# EAGLE schematic Sopranino2GW-181 (EAGLE 9.0.1)
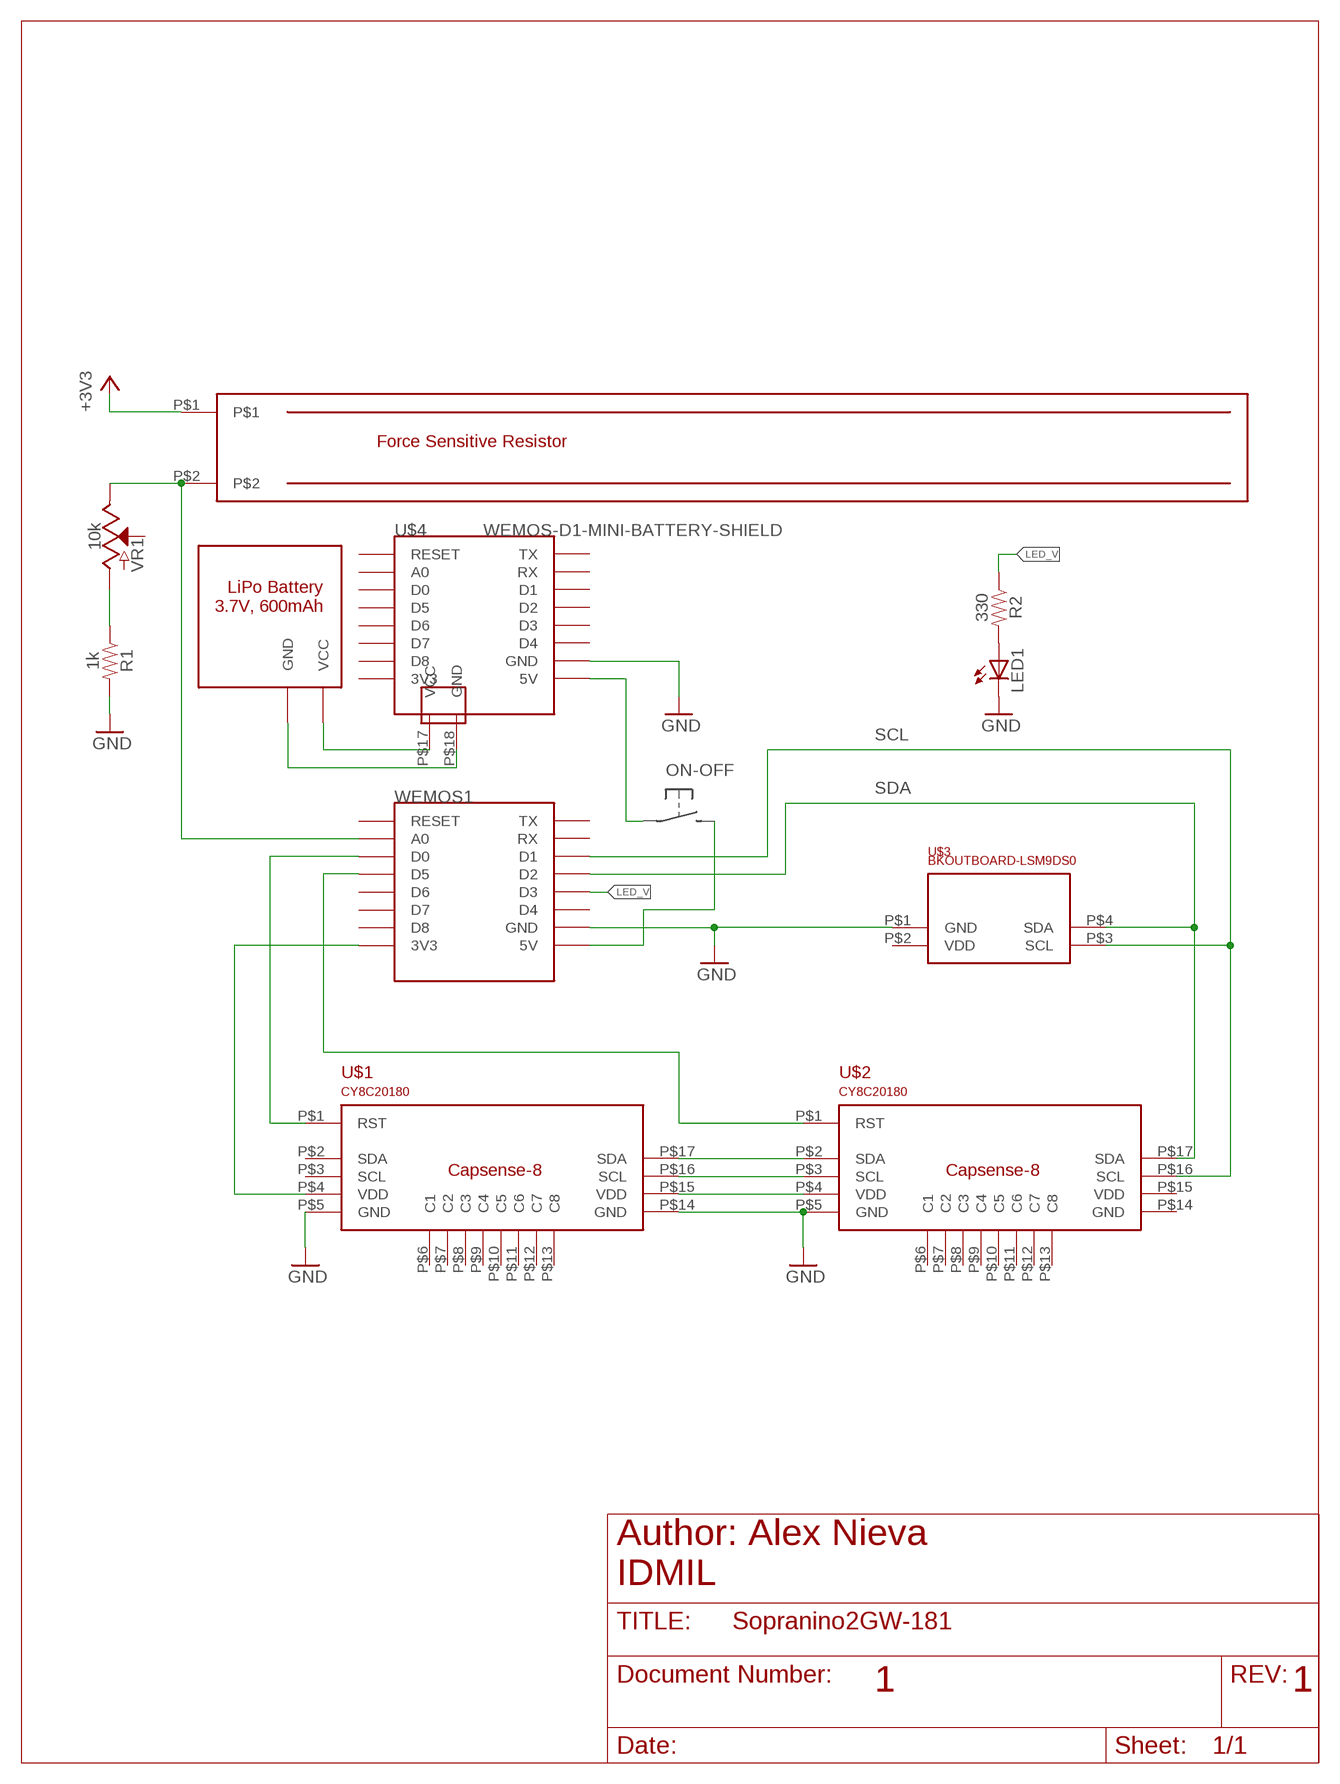
[diagram p0: schematic, sheet 1]

## Parts
LED1  LED3MM  [LED3MM]
R1  1k  1KOHM-HORIZ-1/4W-1%  [AXIAL-0.3]
R2  330  1KOHM-HORIZ-1/4W-1%  [AXIAL-0.3]
U$1  CAPSENSE-8  [CAPSENSE-8]
U$2  CAPSENSE-8  [CAPSENSE-8]
U$3  LSM9DS0_IDMIL_BKOUTBOARD  [LSM9DS0_IDMIL_BKOUTBOARD]
U$4  WEMOS-D1-MINI-BATTERY-SHIELD  [WEMOS-D1-MINI-BATTERY-SHIELD]
U$5  FSR_T-STICK  [FSR_T-STICK]
U$6  LIPO-BATTERY  (no package)
VR1  10k  POTENTIOMETER-PTH-9MM-1/20W-20%  [POT-PTH-ALPS]
WEMOS1  WEMOS-D1-MINI  [WEMOS-D1-MINI]

## Nets
+3V3: U$5.P$1
GND: LED1.K(C) R1.P$2 U$1.P$5(GND) U$1.P$14(GND) U$2.P$5(GND) U$3.P$1(GND) U$4.P$10(GND) WEMOS1.GND
LED_V: R2.P$1 WEMOS1.D3
N$1: U$1.P$1(RST) WEMOS1.D0
N$2: U$2.P$1(RST) WEMOS1.D5
N$3: U$1.P$17(SDA) U$2.P$2(SDA)
N$4: U$4.P$9(5V)
N$5: WEMOS1.5V
N$6: U$1.P$4(VDD) WEMOS1.3V3
N$7: U$1.P$16(SCL) U$2.P$3(SCL)
N$8: U$1.P$15(VDD) U$2.P$4(VDD)
N$9: U$4.P$17(VCC) U$6.VCC
N$10: U$4.P$18(GND) U$6.GND
N$11: LED1.A R2.P$2
N$12: R1.P$1 VR1.P$3(A)
N$13: U$5.P$2 VR1.P$1(E) WEMOS1.A0
SCL: U$2.P$16(SCL) U$3.P$3(SCL) WEMOS1.D1
SDA: U$2.P$17(SDA) U$3.P$4(SDA) WEMOS1.D2
Unconnected: U$1.P$2(SDA) U$1.P$3(SCL) U$1.P$6(C1) U$1.P$7(C2) U$1.P$8(C3) U$1.P$9(C4) U$1.P$10(C5) U$1.P$11(C6) U$1.P$12(C7) U$1.P$13(C8) U$2.P$6(C1) U$2.P$7(C2) U$2.P$8(C3) U$2.P$9(C4) U$2.P$10(C5) U$2.P$11(C6) U$2.P$12(C7) U$2.P$13(C8) U$2.P$14(GND) U$2.P$15(VDD) U$3.P$2(VDD) U$4.P$1(RESET) U$4.P$2(A0) U$4.P$3(D0) U$4.P$4(D5) U$4.P$5(D6) U$4.P$6(D7) U$4.P$7(D8) U$4.P$8(3V3) U$4.P$11(D4) U$4.P$12(D3) U$4.P$13(D2) U$4.P$14(D1) U$4.P$15(RX) U$4.P$16(TX) VR1.P$2(S) WEMOS1.D4 WEMOS1.D6 WEMOS1.D7 WEMOS1.D8 WEMOS1.RESET WEMOS1.RX WEMOS1.TX

## Notes on the sheet
- Author: Alex Nieva
  IDMIL
- 1 | 1

## Library data of the parts
LED1 = led:LED: LED OSRAM: - CHIPLED LG R971, LG N971, LY N971, LG Q971, LY Q971, LO R971, LY R971 LH N974, LH R974 LS Q976, LO Q976, LY Q976 LO Q996 - Hyper CHIPLED LW Q18S LB Q993, LB Q99A, LB R99A - SideLED LS A670, LO A670, LY A670, LG A670, LP A670 LB A673, LV A673, LT A673, LW A673 LH A674 LY A675 LS A676, LA A676, LO A676, LY A676, LW A676 LS A679, LY A679, LG A679 - Hyper Micro SIDELED® LS Y876, LA Y876, LO Y876, LY Y876 LT Y87S - SmartLED LW L88C, LW L88S LB L89C, LB L89S, LG L890 LS L89K, LO L89K, LY L89K LS L896, LA L896, LO L896, LY L896 - TOPLED LS T670, LO T670, LY T670, LG T670, LP T670 LSG T670, LSP T670, LSY T670, LOP T670, LYG T670 LG T671, LOG T671, LSG T671 LB T673, LV T673, LT T673, LW T673 LH T674 LS T676, LA T676, LO T676, LY T676, LB T676, LH T676, LSB T676, LW T676 LB T67C, LV T67C, LT T67C, LS T67K, LO T67K, LY T67K, LW E67C LS E67B, LA E67B, LO E67B, LY E67B, LB E67C, LV E67C, LT E67C LW T67C LS T679, LY T679, LG T679 LS T770, LO T770, LY T770, LG T770, LP T770 LB T773, LV T773, LT T773, LW T773 LH T774 LS E675, LA E675, LY E675, LS T675 LS T776, LA T776, LO T776, LY T776, LB T776 LHGB T686 LT T68C, LB T68C - Hyper Mini TOPLED® LB M676 - Mini TOPLED Santana® LG M470 LS M47K, LO M47K, LY M47K Source: http://www.osram.convergy.de LUXEON: - LUMILED® LXK2-PW12-R00, LXK2-PW12-S00, LXK2-PW14-U00, LXK2-PW14-V00 LXK2-PM12-R00, LXK2-PM12-S00, LXK2-PM14-U00 LXK2-PE12-Q00, LXK2-PE12-R00, LXK2-PE12-S00, LXK2-PE14-T00, LXK2-PE14-U00 LXK2-PB12-K00, LXK2-PB12-L00, LXK2-PB12-M00, LXK2-PB14-N00, LXK2-PB14-P00, LXK2-PB14-Q00 LXK2-PR12-L00, LXK2-PR12-M00, LXK2-PR14-Q00, LXK2-PR14-R00 LXK2-PD12-Q00, LXK2-PD12-R00, LXK2-PD12-S00 LXK2-PH12-R00, LXK2-PH12-S00 LXK2-PL12-P00, LXK2-PL12-Q00, LXK2-PL12-R00 Source: www.luxeon.com KINGBRIGHT: KA-3528ASYC Source: www.kingbright.com
R1 = SparkFun-Resistors:1KOHM: 1kΩ resistor A resistor is a passive two-terminal electrical component that implements electrical resistance as a circuit element. Resistors act to reduce current flow, and, at the same time, act to lower voltage levels within circuits. - Wikipedia; PROD_ID: RES-12182
R2 = SparkFun-Resistors:1KOHM: 1kΩ resistor A resistor is a passive two-terminal electrical component that implements electrical resistance as a circuit element. Resistors act to reduce current flow, and, at the same time, act to lower voltage levels within circuits. - Wikipedia; PROD_ID: RES-12182; VALUE: 1k
U$1 U$2 = T-Stick:CAPSENSE-8: Capsense CY8C20180 for the Sopranino T-Sticks
U$3 = T-Stick:LSM9DS0_IDMIL_BKOUTBOARD
U$4 = T-Stick:WEMOS-D1-MINI-BATTERY-SHIELD: Battery Shield Wemos D1
U$5 = T-Stick:FSR_T-STICK: FSR for the T-Stick DMI
U$6 = T-Stick:LIPO-BATTERY
VR1 = SparkFun-Resistors:POTENTIOMETER: Potentiometer (Pot) Three-terminal potentiometers, with an adjustable wiper and two adjustable resistors. A pot can be used to create a configurable voltage divider, or as a variable resistor. Variants ALPS_POT and ALPS_POT_KIT - PTH, breadboard compatible, 9mm square pots Rotary Potentiometer - Linear (10k ohm) <https://www.sparkfun.com/products/9288> (COM-09288) The KIT variant exposes copper on only one side of the PTH pad, so the part can only be assembled on one side of the PCB. Useful for beginner soldering kits.; PROD_ID: RES-09177; SF_SKU: COM-09288
WEMOS1 = esp8266modules:WEMOS-D1-MINI: WeMos.cc D1 mini ESP8266 module

## Net classes
1 power: width 0.61 mm, clearance 0.254 mm
3 usbvcc: width 0.356 mm, clearance 0.254 mm